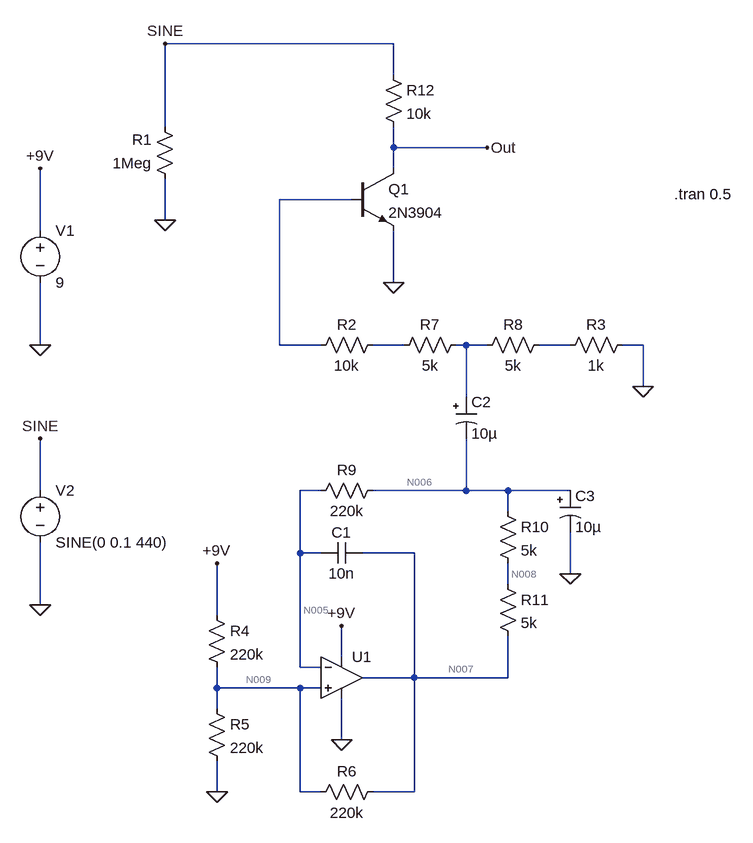
[diagram p0: schematic Tremolo.asc]
Tremolo.asc, the LTspice schematic file:
Version 4.1
SHEET 1 880 1168
WIRE -368 -32 -720 -32
WIRE -368 16 -368 -32
WIRE -720 96 -720 -32
WIRE -368 128 -368 96
WIRE -224 128 -368 128
WIRE -368 160 -368 128
WIRE -432 208 -544 208
WIRE -720 240 -720 176
WIRE -912 256 -912 160
WIRE -368 336 -368 256
WIRE -912 432 -912 336
WIRE -544 432 -544 208
WIRE -480 432 -544 432
WIRE -352 432 -400 432
WIRE -256 432 -272 432
WIRE -224 432 -256 432
WIRE -96 432 -144 432
WIRE 16 432 -16 432
WIRE 16 496 16 432
WIRE -256 512 -256 432
WIRE -912 656 -912 576
WIRE -480 656 -512 656
WIRE -256 656 -256 576
WIRE -256 656 -400 656
WIRE -192 656 -256 656
WIRE -96 656 -192 656
WIRE -192 688 -192 656
WIRE -512 752 -512 656
WIRE -480 752 -512 752
WIRE -336 752 -416 752
WIRE -96 784 -96 720
WIRE -192 800 -192 768
WIRE -912 832 -912 736
WIRE -640 848 -640 768
WIRE -448 912 -448 864
WIRE -512 928 -512 752
WIRE -480 928 -512 928
WIRE -336 944 -336 752
WIRE -336 944 -416 944
WIRE -192 944 -192 880
WIRE -192 944 -336 944
WIRE -640 960 -640 928
WIRE -512 960 -640 960
WIRE -480 960 -512 960
WIRE -640 992 -640 960
WIRE -448 1040 -448 976
WIRE -640 1120 -640 1072
WIRE -512 1120 -512 960
WIRE -480 1120 -512 1120
WIRE -336 1120 -336 944
WIRE -336 1120 -400 1120
FLAG -720 240 0
FLAG 16 496 0
FLAG -96 784 0
FLAG -368 336 0
FLAG -224 128 Out
FLAG -912 432 0
FLAG -448 1040 0
FLAG -640 1120 0
FLAG -448 864 +9V
FLAG -912 160 +9V
FLAG -912 832 0
FLAG -912 576 SINE
FLAG -720 -32 SINE
FLAG -640 768 +9V
SYMBOL res -704 192 R180
WINDOW 0 36 76 Left 2
WINDOW 3 36 40 Left 2
SYMATTR InstName R1
SYMATTR Value 1Meg
SYMBOL npn -432 160 R0
SYMATTR InstName Q1
SYMATTR Value 2N3904
SYMBOL res -384 416 R90
WINDOW 0 0 56 VBottom 2
WINDOW 3 32 56 VTop 2
SYMATTR InstName R2
SYMATTR Value 10k
SYMBOL res 0 416 R90
WINDOW 0 0 56 VBottom 2
WINDOW 3 32 56 VTop 2
SYMATTR InstName R3
SYMATTR Value 1k
SYMBOL res -656 832 R0
SYMATTR InstName R4
SYMATTR Value 220k
SYMBOL res -656 976 R0
SYMATTR InstName R5
SYMATTR Value 220k
SYMBOL OpAmps\\UniversalOpAmp2 -448 944 R0
SYMATTR InstName U1
SYMBOL cap -416 736 R90
WINDOW 0 0 32 VBottom 2
WINDOW 3 32 32 VTop 2
SYMATTR InstName C1
SYMATTR Value 10n
SYMBOL res -384 1104 R90
WINDOW 0 0 56 VBottom 2
WINDOW 3 32 56 VTop 2
SYMATTR InstName R6
SYMATTR Value 220k
SYMBOL polcap -272 512 R0
SYMATTR InstName C2
SYMATTR Value 10µ
SYMBOL polcap -112 656 R0
SYMATTR InstName C3
SYMATTR Value 10µ
SYMBOL res -256 416 R90
WINDOW 0 0 56 VBottom 2
WINDOW 3 32 56 VTop 2
SYMATTR InstName R7
SYMATTR Value 5k
SYMBOL res -128 416 R90
WINDOW 0 0 56 VBottom 2
WINDOW 3 32 56 VTop 2
SYMATTR InstName R8
SYMATTR Value 5k
SYMBOL res -384 640 R90
WINDOW 0 0 56 VBottom 2
WINDOW 3 32 56 VTop 2
SYMATTR InstName R9
SYMATTR Value 220k
SYMBOL res -208 672 R0
SYMATTR InstName R10
SYMATTR Value 5k
SYMBOL res -208 784 R0
SYMATTR InstName R11
SYMATTR Value 5k
SYMBOL voltage -912 240 R0
WINDOW 123 0 0 Left 0
WINDOW 39 0 0 Left 0
SYMATTR InstName V1
SYMATTR Value 9
SYMBOL voltage -912 640 R0
WINDOW 123 0 0 Left 0
WINDOW 39 0 0 Left 0
SYMATTR InstName V2
SYMATTR Value SINE(0 0.1 440)
SYMBOL res -384 0 R0
SYMATTR InstName R12
SYMATTR Value 10k
TEXT 64 200 Left 2 !.tran 0.5

The netlist it stands for:
* Tremolo.asc
R1 0 SINE 1Meg
Q1 Out N001 0 0 2N3904
R2 N002 N001 10k
R3 0 N004 1k
R4 +9V N009 220k
R5 N009 0 220k
X§U1 N009 N005 +9V 0 N007 level2 Avol=1Meg GBW=10Meg Slew=10Meg Ilimit=25m Rail=0 Vos=0 En=0 Enk=0 In=0 Ink=0 Rin=500Meg  ; pins In+ In- V+ V- OUT
C1 N007 N005 10n
R6 N007 N009 220k
C2 N003 N006 10µ
C3 N006 0 10µ
R7 N003 N002 5k
R8 N004 N003 5k
R9 N006 N005 220k
R10 N006 N008 5k
R11 N008 N007 5k
V1 +9V 0 9
V2 SINE 0 SINE(0 0.1 440)
R12 SINE Out 10k
.model NPN NPN
.model PNP PNP
.lib standard.bjt
.tran 0.5
.lib UniversalOpAmp2.lib
.backanno
.end

* Results of the author's LTspice run, read from the files saved beside the schematic
* Operating Point, zero values left out:
*   V(+9v) = 9 V
*   V(n005) = 4.5 V
*   V(n006) = 4.5 V
*   V(n007) = 4.5 V
*   V(n008) = 4.5 V
*   V(n009) = 4.5 V
*   I(R4) = 20.45 µA
*   I(R5) = 20.45 µA
*   I(V1) = -470.4 µA
*   Ix(u1:3) = 450 µA
*   Ix(u1:4) = -450 µA
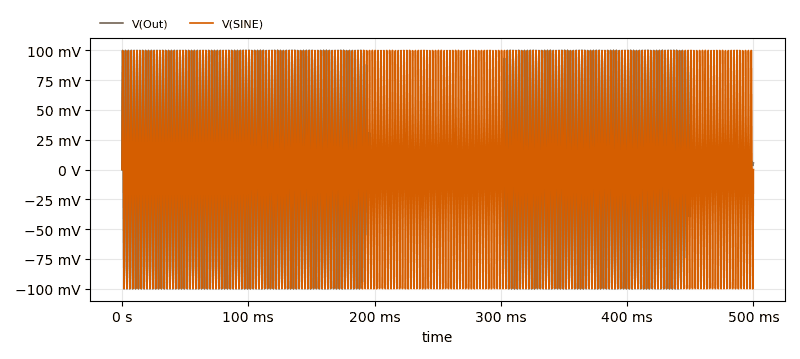
[diagram p1: Transient Analysis of Tremolo.asc, plotted from the saved traces]
* Transient Analysis, 1 run:
*   V(Out): min -100 mV, max 100 mV, average 1.983 mV, rms 59.25 mV, last 5.678 mV
*   V(SINE): min -100 mV, max 100 mV, average 2.396 µV, rms 71.83 mV, last 0 V